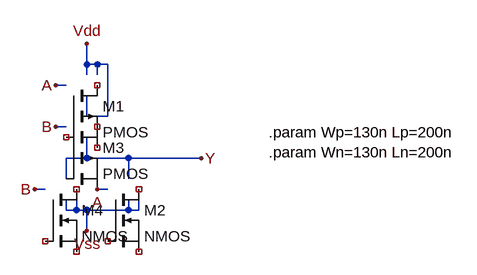
[diagram p0: schematic nor.asc]
nor.asc, the LTspice schematic file:
Version 4
SHEET 1 880 680
WIRE -160 -208 -160 -240
WIRE -144 -208 -160 -208
WIRE -128 -208 -144 -208
WIRE -160 -192 -160 -208
WIRE -144 -192 -144 -208
WIRE -192 -176 -208 -176
WIRE -160 -128 -160 -160
WIRE -128 -128 -128 -208
WIRE -128 -128 -144 -128
WIRE -192 -112 -208 -112
WIRE -160 -64 -160 -96
WIRE -160 -64 -192 -64
WIRE -96 -64 -160 -64
WIRE 16 -64 -96 -64
WIRE -192 -32 -192 -64
WIRE -96 -32 -96 -64
WIRE -224 -16 -240 -16
WIRE -128 -16 -144 -16
WIRE -192 16 -192 0
WIRE -176 16 -176 0
WIRE -176 16 -192 16
WIRE -160 16 -176 16
WIRE -96 16 -96 0
WIRE -96 16 -160 16
WIRE -80 16 -80 0
WIRE -80 16 -96 16
WIRE -160 48 -160 16
FLAG 16 -64 Y
FLAG -208 -176 A
FLAG -160 48 Vss
FLAG -160 -240 Vdd
FLAG -240 -16 B
FLAG -144 -16 A
FLAG -208 -112 B
SYMBOL pmos -192 -176 R0
SYMATTR InstName M1
SYMATTR SpiceLine W={Wp} L={Lp}
SYMBOL nmos -128 -16 R0
SYMATTR InstName M2
SYMATTR SpiceLine W={Wn} L={Ln}
SYMBOL pmos -192 -112 R0
SYMATTR InstName M3
SYMATTR SpiceLine W={Wp} L={Lp}
SYMBOL nmos -224 -16 R0
SYMATTR InstName M4
SYMATTR SpiceLine W={Wn} L={Ln}
TEXT 120 -104 Left 2 !.param Wp=130n Lp=200n\n.param Wn=130n Ln=200n

The netlist it stands for:
* nor.asc
* M1: PMOS W={Wp} L={Lp} (symbol pmos not certain, pin order unknown); nets seen at it: 
* M2: NMOS W={Wn} L={Ln} (symbol nmos not certain, pin order unknown); nets seen at it: 
* M3: PMOS W={Wp} L={Lp} (symbol pmos not certain, pin order unknown); nets seen at it: A, Y
* M4: NMOS W={Wn} L={Ln} (symbol nmos not certain, pin order unknown); nets seen at it: 
.param Wp=130n Lp=200n
.param Wn=130n Ln=200n
.backanno
.end